# Altium schematic sheet voltage_regulator.SchDoc
size A; SheetNumber: 2; SheetTotal: 2
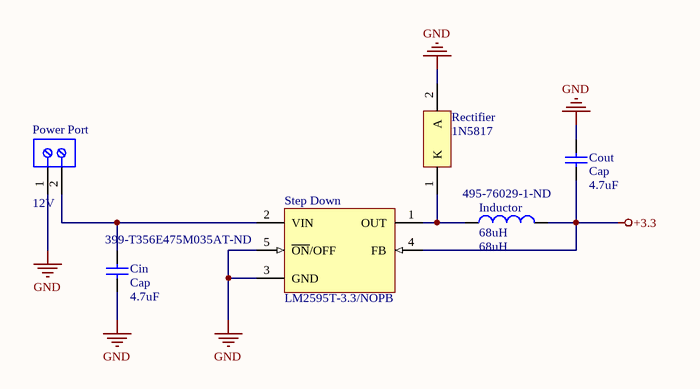
[diagram p0: voltage_regulator.SchDoc]

## Parts
Cin  Cap  value 4.7uF  Supplier Part Number 1: 399-T356E475M035AT-ND  [RAD-0.3]
Cout  Cap  value 4.7uF  [RAD-0.3]
Inductor  68uH  Supplier Part Number 1: 495-76029-1-ND  [0402-A]
Power_Port  12V  [691102710002]
Rectifier  1N5817  [ONSC-AXIAL_LEAD-2-59-10_P]
Step_Down  LM2595T-3.3/NOPB  [NDH0005A]

## Nets
+3.3: Cout.1 Inductor.2 Step_Down.4(FB)
GND: Cin.1 Cout.2 Power_Port.1 Rectifier.2(A) Step_Down.3(GND) Step_Down.5(~{ON}/OFF)
NetCin_2: Cin.2 Power_Port.2 Step_Down.2(VIN)
NetInductor_1: Inductor.1 Rectifier.1(K) Step_Down.1(OUT)

## Library data of the parts
Cin Cout = Cap: Capacitor; Published: 8-Jun-2000; LatestRevisionDate: 17-Jul-2002; LatestRevisionNote: Re-released for DXP Platform.; PackageReference: RAD-0.3; Publisher: Altium Limited; PackageDescription: Radial Cap, Thru-Hole; 2 Leads; 0.3 in Pin Spacing
  Cin: Supplier 1: Digi-Key
Inductor = Inductor: Code_IEC: 1005; Published: 8-Jun-2000; LatestRevisionDate: 29-May-2009; LatestRevisionNote: IPC-7351 Footprint Added.; PackageReference: 0402-A; Publisher: Altium Limited; PackageDescription: Chip Inductor; Code_JEITA: 0402; Value: 68uH; Supplier 1: Digi-Key
Power_Port = CMP-1502-03258-1: Series 102 - 5.00 mm Horizontal Entry Modular with Pressure Clamp WR-TBL, 2 pin / 691102710002; Manufacturer: Wurth Elektronik; Pin Number: 2; Pitch: 5.00mm; Manufacturer URL: http://www.we-online.de; Mounting Technology: THT; Publisher: WurthElektronik; Packaging: Box; Package Reference: 691102710002; Datasheet URL: http://katalog.we-online.de/em/datasheet/6911027100xx.pdf; Operating Temperature: -40to105degC; Part Number: 691102710002
Rectifier = CMP-1055-00036-1: Rectifier, 2-Pin Axial_Lead, Pb-Free, Bulk Bag; Manufacturer: On Semiconductor; Configuration: Single; IFSM Max (A): 25; Note1: 0; ComponentLink3Description: Package Specification; ComponentLink1URL: http://www.onsemi.com/; ComponentLink2Description: Datasheet; ComponentLink1Description: Manufacturer URL; PackageVersion: Rev. U, 02/2005; DatasheetVersion: Rev. 10; PackageDescription: 2-Pin, Axial Lead, Diameter 2.35 mm; RoHS: TRUE; PackageReference: AXIAL_LEAD-2-59-10; ComponentLink3URL: http://www.onsemi.cn/pub_link/Collateral/59-10.PDF; ComponentLink2URL: http://www.onsemi.cn/pub_link/Collateral/1N5817-D.PDF; Packing: Bulk Bag; PartNumber: 1N5817; Mounting Technology: Through Hole
Step_Down = CMP-0069-01922-3: SIMPLE SWITCHER® Power Converter 150 KHz 1A Step-Down Voltage Regulator, 5-pin TO-220, Pb-Free; Manufacturer: Texas Instruments; PowerWise: N; PackageTopMarking: NSUZXYTTE#*LM2595T*-3.3 P+; CompType: Switcher; PackageReference: NDH0005A; ComponentLink1URL: http://www.ti.com/general/docs/lit/getliterature.tsp?genericPartNumber=LM2595&fileType=pdf; RoHS: Y; PinCount: 5; ComponentLink1Description: Datasheet URL; PackageDescription: TO-220, Molded, Stagger Bend, 5 Lead